# Altium schematic sheet connect.SchDoc
size A4; SheetNumber: 1; SheetTotal: 5
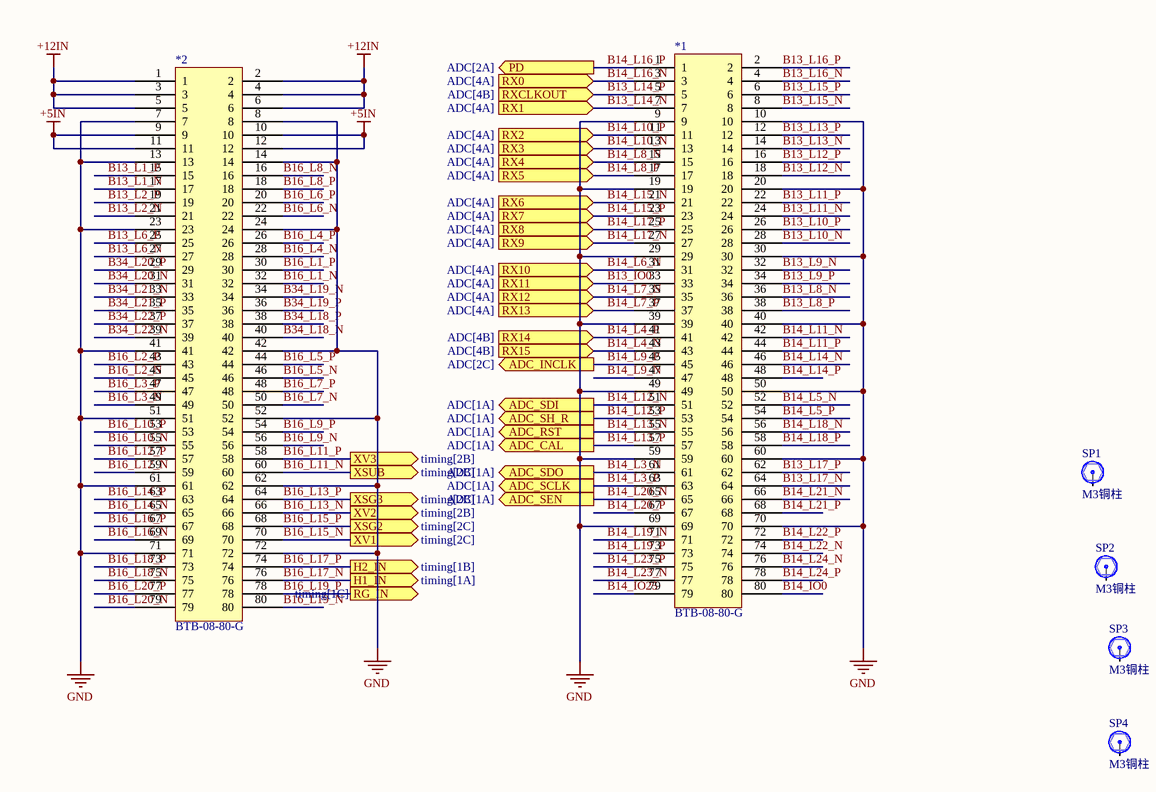
[diagram p0: connect.SchDoc]

## Parts
*1  BTB-08-80-G  [BTB-08-80-G]
*2  BTB-08-80-G  [BTB-08-80-G]
SP1  M3铜柱  [M3x5_N]
SP2  M3铜柱  [M3x5_N]
SP3  M3铜柱  [M3x5_N]
SP4  M3铜柱  [M3x5_N]

## Ports
ADC_CAL (out, see ADC[1A]), ADC_INCLK (out, see ADC[2C]), ADC_RST (out, see ADC[1A]), ADC_SCLK (out, see ADC[1A]), ADC_SDI (out, see ADC[1A]), ADC_SDO (out, see ADC[1A]), ADC_SEN (out, see ADC[1A]), ADC_SH_R (out, see ADC[1A]), H1_IN (out, see timing[1A]), H2_IN (out, see timing[1B]), PD (out, see ADC[2A]), RG_IN (out, see timing[1C]), RX0 (in, see ADC[4A]), RX1 (in, see ADC[4A]), RX2 (in, see ADC[4A]), RX3 (in, see ADC[4A]), RX4 (in, see ADC[4A]), RX5 (in, see ADC[4A]), RX6 (in, see ADC[4A]), RX7 (in, see ADC[4A]), RX8 (in, see ADC[4A]), RX9 (in, see ADC[4A]), RX10 (in, see ADC[4A]), RX11 (in, see ADC[4A]), RX12 (in, see ADC[4A]), RX13 (in, see ADC[4A]), RX14 (in, see ADC[4B]), RX15 (in, see ADC[4B]), RXCLKOUT (in, see ADC[4B]), XSG2 (out, see timing[2C]), XSG3 (out, see timing[2B]), XSUB (out, see timing[2B]), XV1 (out, see timing[2C]), XV2 (out, see timing[2B]), XV3 (out, see timing[2B])

## Nets
+5IN: *2.9 *2.10 *2.11 *2.12
+12IN: *2.1 *2.2 *2.3 *2.4 *2.5 *2.6
GND: *1.9 *1.10 *1.19 *1.20 *1.29 *1.30 *1.39 *1.40 *1.49 *1.50 *1.59 *1.60 *1.69 *1.70 *2.7 *2.8 *2.13 *2.14 *2.23 *2.24 *2.41 *2.42 *2.51 *2.52 *2.61 *2.62 *2.71 *2.72
B13_IO0: *1.33 ; port RX11
B13_L1_N: *2.17
B13_L1_P: *2.15
B13_L2_N: *2.21
B13_L2_P: *2.19
B13_L6_N: *2.27
B13_L6_P: *2.25
B13_L8_N: *1.36
B13_L8_P: *1.38
B13_L9_N: *1.32
B13_L9_P: *1.34
B13_L10_N: *1.28
B13_L10_P: *1.26
B13_L11_N: *1.24
B13_L11_P: *1.22
B13_L12_N: *1.18
B13_L12_P: *1.16
B13_L13_N: *1.14
B13_L13_P: *1.12
B13_L14_N: *1.7 ; port RX1
B13_L14_P: *1.5 ; port RXCLKOUT
B13_L15_N: *1.8
B13_L15_P: *1.6
B13_L16_N: *1.4
B13_L16_P: *1.2
B13_L17_N: *1.64
B13_L17_P: *1.62
B14_IO0: *1.80
B14_IO25: *1.79
B14_L3_N: *1.61 ; port ADC_SDO
B14_L3_P: *1.63 ; port ADC_SCLK
B14_L4_N: *1.43 ; port RX15
B14_L4_P: *1.41 ; port RX14
B14_L5_N: *1.52
B14_L5_P: *1.54
B14_L6_N: *1.31 ; port RX10
B14_L7_N: *1.35 ; port RX12
B14_L7_P: *1.37 ; port RX13
B14_L8_N: *1.15 ; port RX4
B14_L8_P: *1.17 ; port RX5
B14_L9_N: *1.47
B14_L9_P: *1.45 ; port ADC_INCLK
B14_L10_N: *1.13 ; port RX3
B14_L10_P: *1.11 ; port RX2
B14_L11_N: *1.42
B14_L11_P: *1.44
B14_L12_N: *1.51 ; port ADC_SDI
B14_L12_P: *1.53 ; port ADC_SH_R
B14_L13_N: *1.55 ; port ADC_RST
B14_L13_P: *1.57 ; port ADC_CAL
B14_L14_N: *1.46
B14_L14_P: *1.48
B14_L15_N: *1.21 ; port RX6
B14_L15_P: *1.23 ; port RX7
B14_L16_N: *1.3 ; port RX0
B14_L16_P: *1.1 ; port PD
B14_L17_N: *1.27 ; port RX9
B14_L17_P: *1.25 ; port RX8
B14_L18_N: *1.56
B14_L18_P: *1.58
B14_L19_N: *1.71
B14_L19_P: *1.73
B14_L20_N: *1.65 ; port ADC_SEN
B14_L20_P: *1.67
B14_L21_N: *1.66
B14_L21_P: *1.68
B14_L22_N: *1.74
B14_L22_P: *1.72
B14_L23_N: *1.77
B14_L23_P: *1.75
B14_L24_N: *1.76
B14_L24_P: *1.78
B16_L1_N: *2.32
B16_L1_P: *2.30
B16_L2_N: *2.45
B16_L2_P: *2.43
B16_L3_N: *2.49
B16_L3_P: *2.47
B16_L4_N: *2.28
B16_L4_P: *2.26
B16_L5_N: *2.46
B16_L5_P: *2.44
B16_L6_N: *2.22
B16_L6_P: *2.20
B16_L7_N: *2.50
B16_L7_P: *2.48
B16_L8_N: *2.16
B16_L8_P: *2.18
B16_L9_N: *2.56
B16_L9_P: *2.54
B16_L10_N: *2.55
B16_L10_P: *2.53
B16_L11_N: *2.60 ; port XSUB
B16_L11_P: *2.58 ; port XV3
B16_L12_N: *2.59
B16_L12_P: *2.57
B16_L13_N: *2.66 ; port XV2
B16_L13_P: *2.64 ; port XSG3
B16_L14_N: *2.65
B16_L14_P: *2.63
B16_L15_N: *2.70 ; port XV1
B16_L15_P: *2.68 ; port XSG2
B16_L16_N: *2.69
B16_L16_P: *2.67
B16_L17_N: *2.76 ; port H1_IN
B16_L17_P: *2.74 ; port H2_IN
B16_L18_N: *2.75
B16_L18_P: *2.73
B16_L19_N: *2.80
B16_L19_P: *2.78 ; port RG_IN
B16_L20_N: *2.79
B16_L20_P: *2.77
B34_L18_N: *2.40
B34_L18_P: *2.38
B34_L19_N: *2.34
B34_L19_P: *2.36
B34_L20_N: *2.31
B34_L20_P: *2.29
B34_L21_N: *2.33
B34_L21_P: *2.35
B34_L22_N: *2.39
B34_L22_P: *2.37

Not connected (* = marked no-connect by the designer): SP1 1; SP2 1; SP3 1; SP4 1

## Library data of the parts
SP1-SP4 = 铜柱大焊盘: 铜柱; 版权归属: 封装库来自淘宝 ID：黄晶宝石; BOM名称: 铜柱; 学习资源: https://shop463601444.taobao.com